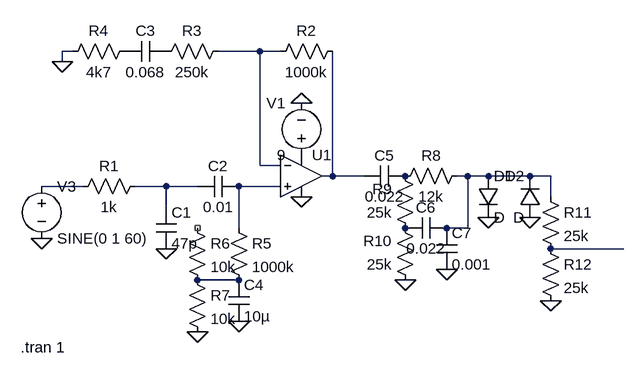
[diagram p0: schematic BOSSDis.asc]
BOSSDis.asc, the LTspice schematic file:
Version 4
SHEET 1 880 680
WIRE -16 -80 -32 -80
WIRE 272 -80 208 -80
WIRE 304 -80 272 -80
WIRE -32 -64 -32 -80
WIRE 272 96 272 -80
WIRE 304 96 272 96
WIRE 384 112 384 -80
WIRE 384 112 368 112
WIRE 432 112 384 112
WIRE 592 112 576 112
WIRE 624 112 592 112
WIRE 688 112 624 112
WIRE 720 112 688 112
WIRE 0 128 -64 128
WIRE 128 128 80 128
WIRE 176 128 128 128
WIRE 304 128 240 128
WIRE 720 144 720 112
WIRE 128 160 128 128
WIRE 240 192 240 128
WIRE 592 192 592 112
WIRE 592 192 560 192
WIRE 832 224 720 224
WIRE 240 272 176 272
FLAG -32 -64 0
FLAG 128 224 0
FLAG 176 352 0
FLAG 240 336 0
FLAG 496 272 0
FLAG 560 256 0
FLAG 720 304 0
FLAG 688 176 0
FLAG 624 176 0
FLAG -64 208 0
FLAG 336 0 0
FLAG 336 144 0
SYMBOL res 96 112 R90
WINDOW 0 0 56 VBottom 2
WINDOW 3 32 56 VTop 2
SYMATTR InstName R1
SYMATTR Value 1k
SYMBOL cap 112 160 R0
SYMATTR InstName C1
SYMATTR Value 47p
SYMBOL cap 240 112 R90
WINDOW 0 0 32 VBottom 2
WINDOW 3 32 32 VTop 2
SYMATTR InstName C2
SYMATTR Value 0.01
SYMBOL OpAmps\\UniversalOpAmp 336 112 R0
SYMATTR InstName U1
SYMBOL res 400 -96 R90
WINDOW 0 0 56 VBottom 2
WINDOW 3 32 56 VTop 2
SYMATTR InstName R2
SYMATTR Value 1000k
SYMBOL res 224 -96 R90
WINDOW 0 0 56 VBottom 2
WINDOW 3 32 56 VTop 2
SYMATTR InstName R3
SYMATTR Value 250k
SYMBOL cap 128 -96 R90
WINDOW 0 0 32 VBottom 2
WINDOW 3 32 32 VTop 2
SYMATTR InstName C3
SYMATTR Value 0.068
SYMBOL res 80 -96 R90
WINDOW 0 0 56 VBottom 2
WINDOW 3 32 56 VTop 2
SYMATTR InstName R4
SYMATTR Value 4k7
SYMBOL res 224 176 R0
SYMATTR InstName R5
SYMATTR Value 1000k
SYMBOL res 160 176 R0
SYMATTR InstName R6
SYMATTR Value 10k
SYMBOL res 160 256 R0
SYMATTR InstName R7
SYMATTR Value 10k
SYMBOL cap 224 272 R0
SYMATTR InstName C4
SYMATTR Value 10µ
SYMBOL cap 496 96 R90
WINDOW 0 0 32 VBottom 2
WINDOW 3 32 32 VTop 2
SYMATTR InstName C5
SYMATTR Value 0.022
SYMBOL res 592 96 R90
WINDOW 0 0 56 VBottom 2
WINDOW 3 32 56 VTop 2
SYMATTR InstName R8
SYMATTR Value 12k
SYMBOL res 512 208 R180
WINDOW 0 36 76 Left 2
WINDOW 3 36 40 Left 2
SYMATTR InstName R9
SYMATTR Value 25k
SYMBOL cap 560 176 R90
WINDOW 0 0 32 VBottom 2
WINDOW 3 32 32 VTop 2
SYMATTR InstName C6
SYMATTR Value 0.022
SYMBOL res 512 288 R180
WINDOW 0 36 76 Left 2
WINDOW 3 36 40 Left 2
SYMATTR InstName R10
SYMATTR Value 25k
SYMBOL cap 544 192 R0
SYMATTR InstName C7
SYMATTR Value 0.001
SYMBOL res 704 128 R0
SYMATTR InstName R11
SYMATTR Value 25k
SYMBOL res 704 208 R0
SYMATTR InstName R12
SYMATTR Value 25k
SYMBOL diode 608 112 R0
SYMATTR InstName D1
SYMBOL diode 704 176 R180
WINDOW 0 24 64 Left 2
WINDOW 3 24 0 Left 2
SYMATTR InstName D2
SYMBOL voltage 336 96 R180
WINDOW 0 24 96 Left 2
WINDOW 3 24 16 Left 2
WINDOW 123 0 0 Left 0
WINDOW 39 0 0 Left 0
SYMATTR InstName V1
SYMATTR Value 9
SYMBOL voltage -64 112 R0
WINDOW 123 0 0 Left 0
WINDOW 39 0 0 Left 0
SYMATTR InstName V3
SYMATTR Value SINE(0 1 60)
TEXT -96 376 Left 2 !.tran 1

The netlist it stands for:
* BOSSDis.asc
R1 N005 N004 1k
C1 N005 0 47p
C2 N006 N005 0.01
XU1 N006 N001 P001 0 N002 level1 Avol=1Meg GBW=10Meg Vos=0 En=0 Enk=0 In=0 Ink=0 Rin=500Meg  ; pins In+ In- V+ V- OUT
R2 N002 N001 1000k
R3 N001 P002 250k
C3 P002 P003 0.068
R4 P003 0 4k7
R5 N006 N008 1000k
R6 NC_01 N008 10k
R7 N008 0 10k
C4 N008 0 10µ
C5 P004 N002 0.022
R8 N003 P004 12k
R9 P005 P004 25k
C6 N003 P005 0.022
R10 0 P005 25k
C7 N003 0 0.001
R11 N003 N007 25k
R12 N007 0 25k
D1 N003 0 D
D2 0 N003 D
V1 P001 0 9
V3 N004 0 SINE(0 1 60)
.model D D
.lib standard.dio
.tran 1
.lib UniversalOpAmp1.lib
.backanno
.end